# EAGLE design 5vacd (EAGLE 9.6.2)
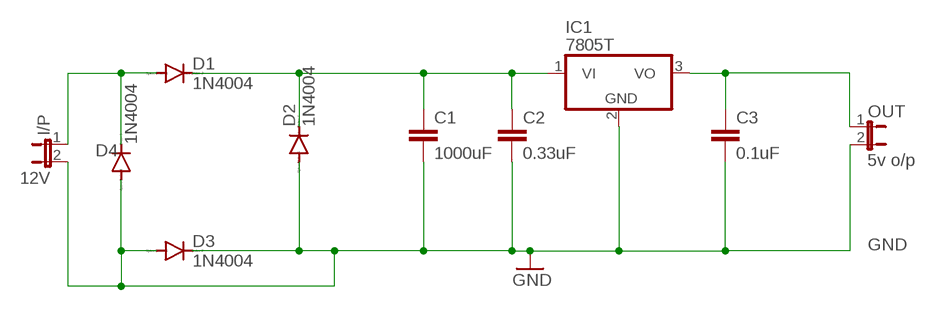
[diagram p0: schematic, sheet 1]

## Parts
C1  1000uF  C2,5-3  [C2.5-3]
C2  0.33uF  C2,5-3  [C2.5-3]
C3  0.1uF  C2,5-3  [C2.5-3]
D1  1N4004  [DO41-10]
D2  1N4004  [DO41-10]
D3  1N4004  [DO41-10]
D4  1N4004  [DO41-10]
I/P  12V  JP1E  [JP1]
IC1  7805T  [TO220H]
OUT  5v o/p  JP1E  [JP1]

## Nets
GND: C1.2 C2.2 C3.2 D2.A D3.A D3.C D4.A I/P.2 IC1.2(GND) OUT.2
N$1: D1.A D4.C I/P.1
N$5: C1.1 C2.1 D1.C D2.C IC1.1(VI)
N$6: C3.1 IC1.3(VO) OUT.1

## Library data of the parts
C1-C3 = capacitor-wima:C: CAPACITOR naming: grid - package width
D1-D4 = diode:1N4004: DIODE general purpose rectifier, 1 A
I/P OUT = jumper:JP1E: JUMPER
IC1 = linear:78*: Positive VOLTAGE REGULATOR Source: http://cache.national.com/ds/LM/LM78L05.pdf http://www.fairchildsemi.com/ds/LM/LM7805.pdf

## Board
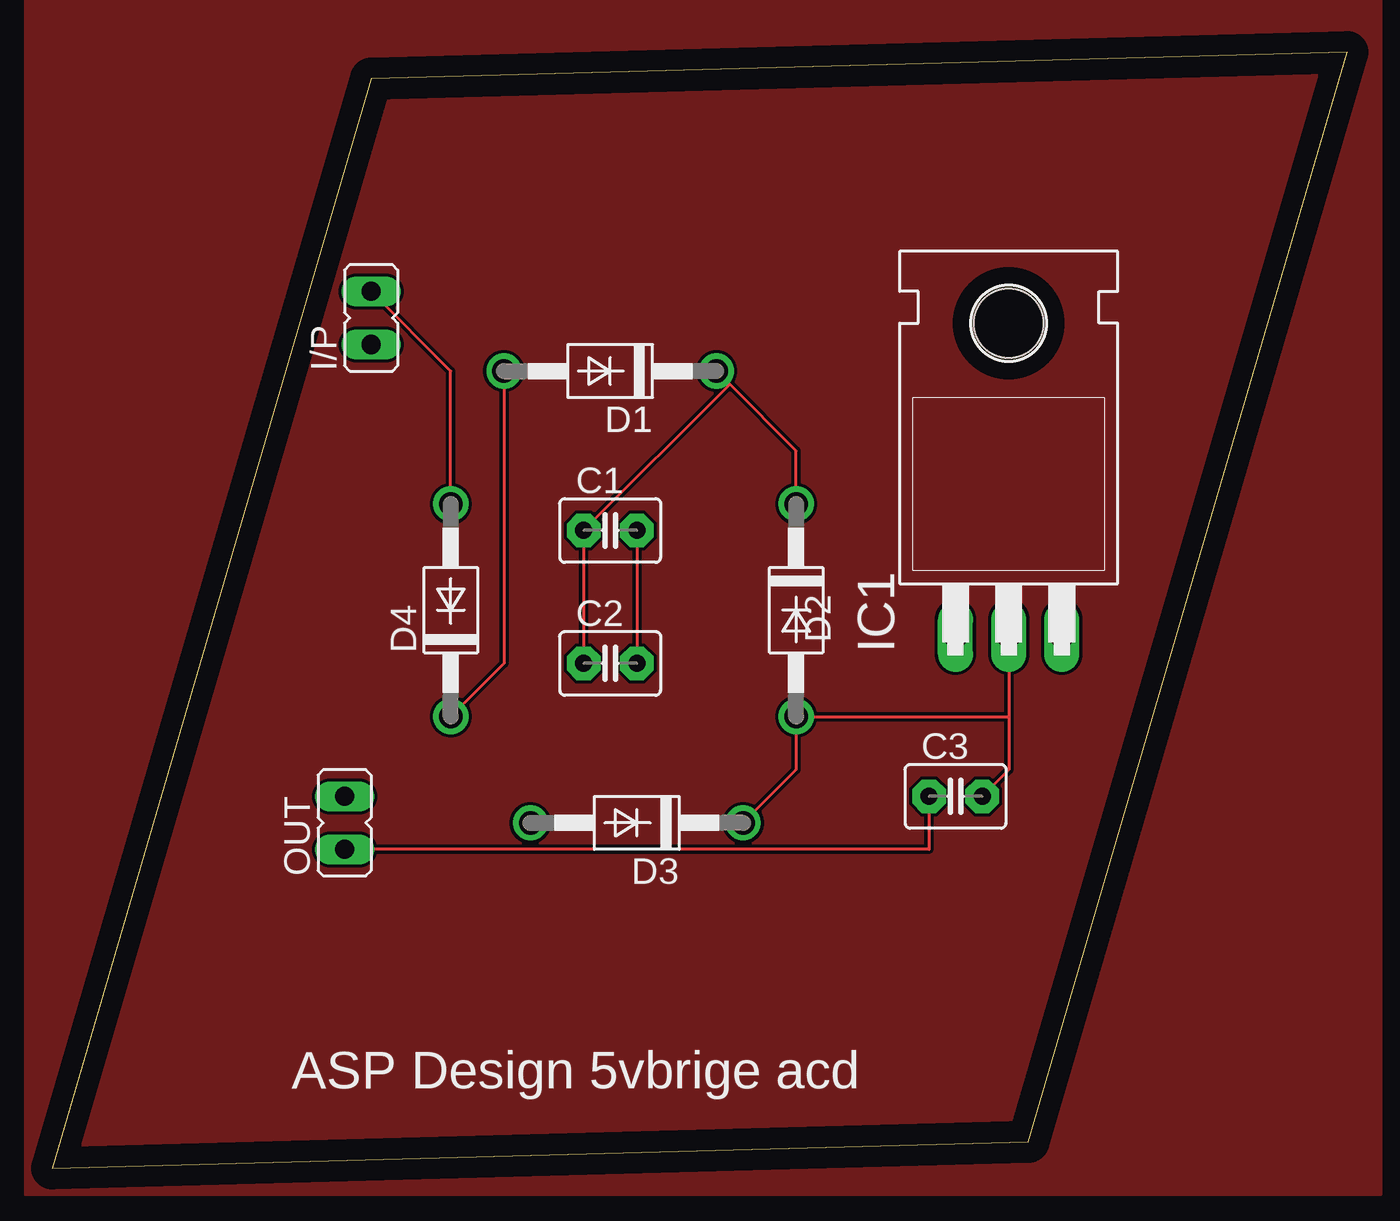
[diagram p1: board, top side]
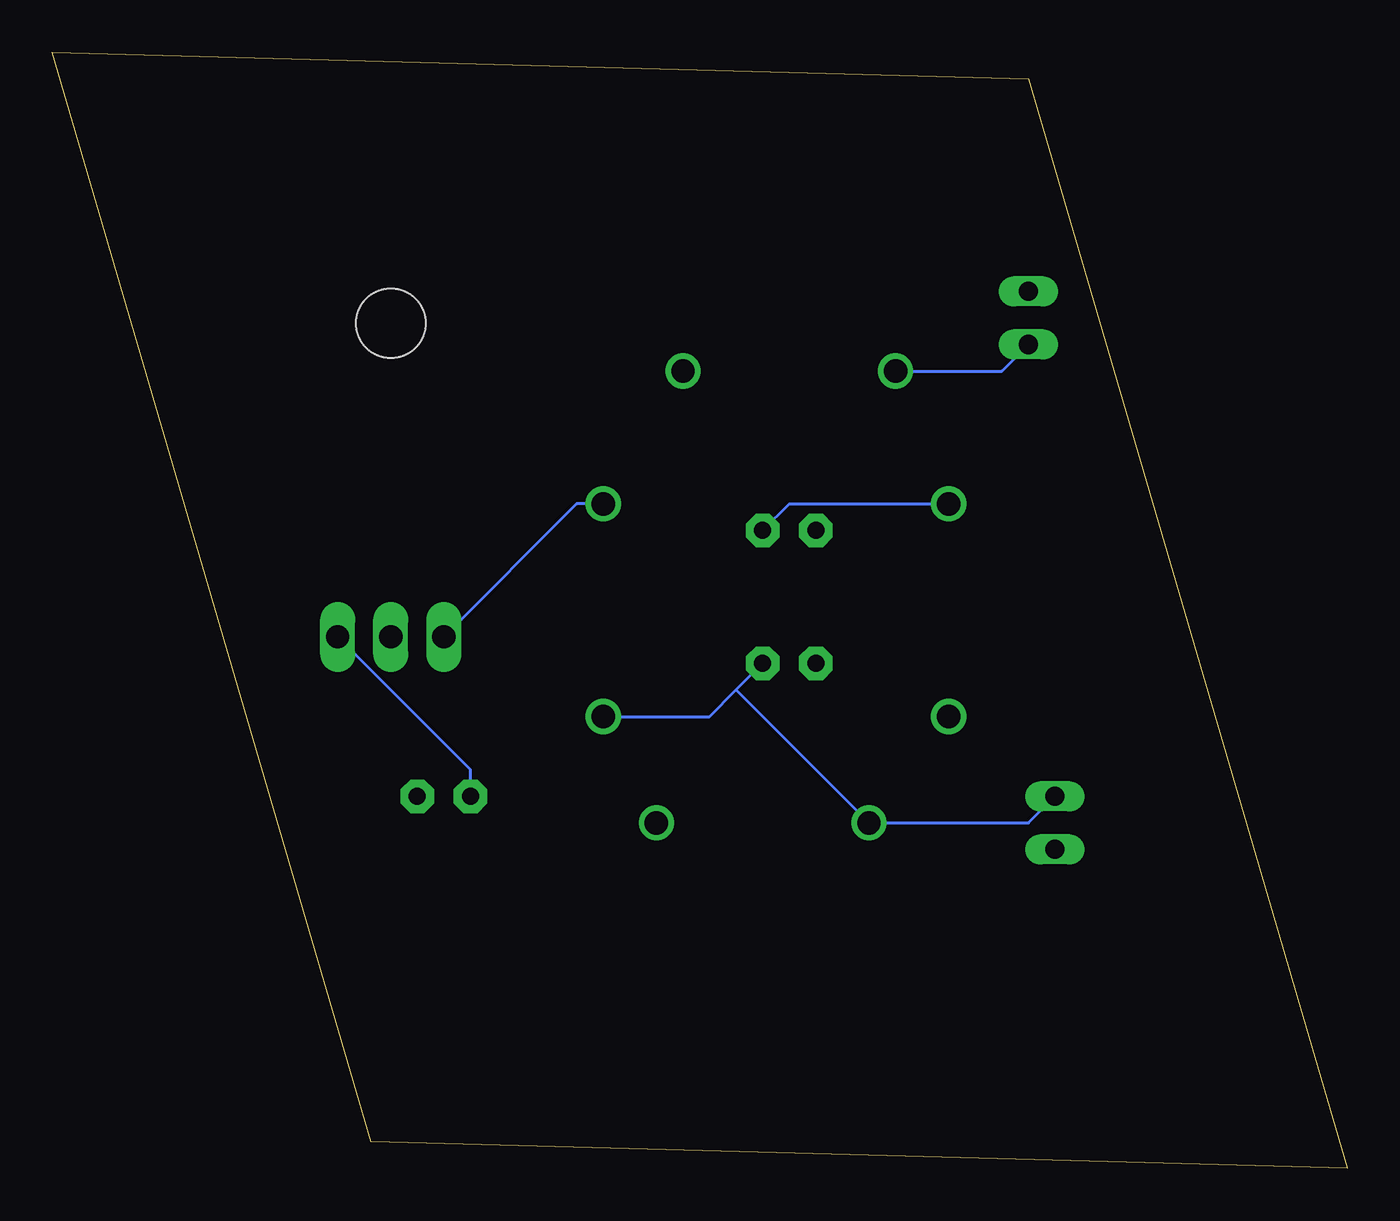
[diagram p2: board, bottom side, seen from below]

Size 61.9 x 53.33 mm. Coordinates in mm from the lower left corner, seen from the top.
Outline: 0,0 46.66,1.27 61.9,53.33 15.24,52.06 0,0
Copper layers (1*16): Top 0.035mm / dielectric 1.5mm / Bottom 0.035mm
Design rules "default": minimum track width 6mil, minimum drill 0.35mm, track to track 6mil, track to pad 6mil, pad to pad 6mil, via to via 6mil, smd to smd 6mil, copper to edge 40mil, drill to drill 6mil, minimum pad ring 10mil, minimum via ring 8mil, stop-mask expansion 4mil, vias tented up to drill 0mil, thermal gap 10mil

### Footprints (pad centres in the part's own frame; a part is rotated, then mirrored left to right if it is on the bottom)
C2.5-3 = drill 0.813 pad 1.6 octagon: 1 -1.27,0; 2 1.27,0
DO41-10 = drill 1.118: A 5.08,0; C -5.08,0
JP1 = drill 0.914 long: 1 0,-1.27; 2 0,1.27
TO220H = drill 1.118 long: 1 -2.54,-10.16; 2 0,-10.16; 3 2.54,-10.16 | hole 3.302: 0,4.826

### Placement (x,y rotation side)
C1  26.67,30.48 0 top
C2  26.67,24.13 0 top
C3  43.18,17.78 0 top
D1  26.67,38.1 180 top
D2  35.56,26.67 270 top
D3  27.94,16.51 180 top
D4  19.05,26.67 90 top
I/P  15.24,40.64 0 top
IC1  45.72,35.56 0 top
OUT  13.97,16.51 0 top

### Tracks (layer width: path | path; a pad name or v marks a point on that pad's centre or on a via)
GND
  Top 0.152: I/P.2 19.05,38.1 D4.A | C3.2 45.72,19.05 45.72,21.59 | IC1.2 45.72,21.59 | C1.2 C2.2 | D3.C 35.56,19.05 D2.A 45.72,21.59
  Bottom 0.152: OUT.2 15.24,16.51 D3.A 29.21,22.86 | 29.21,22.86 30.48,21.59 D2.A | 29.21,22.86 C2.2 | D4.A 26.67,31.75 C1.2
N$1
  Top 0.152: D4.C 21.59,24.13 D1.A
  Bottom 0.152: I/P.1 16.51,38.1 D1.A
N$5
  Top 0.152: C2.1 C1.1 32.39,37.46 | 32.39,37.46 35.56,34.29 D2.C | 32.39,37.46 D1.C
  Bottom 0.152: IC1.1 36.83,31.75 D2.C
N$6
  Top 0.152: OUT.1 41.91,15.24 C3.1
  Bottom 0.152: IC1.3 41.91,19.05 C3.1
TOPLYER
  pour Top: 1.27,55.88 63.5,55.88 63.5,-1.27 -1.27,-1.27 -1.27,55.88

### Text on the board
tPlace: ASP Design 5vbrige acd